# EAGLE schematic Musical_Grasping_Training_Aid_Schematic (EAGLE 9.7.0)
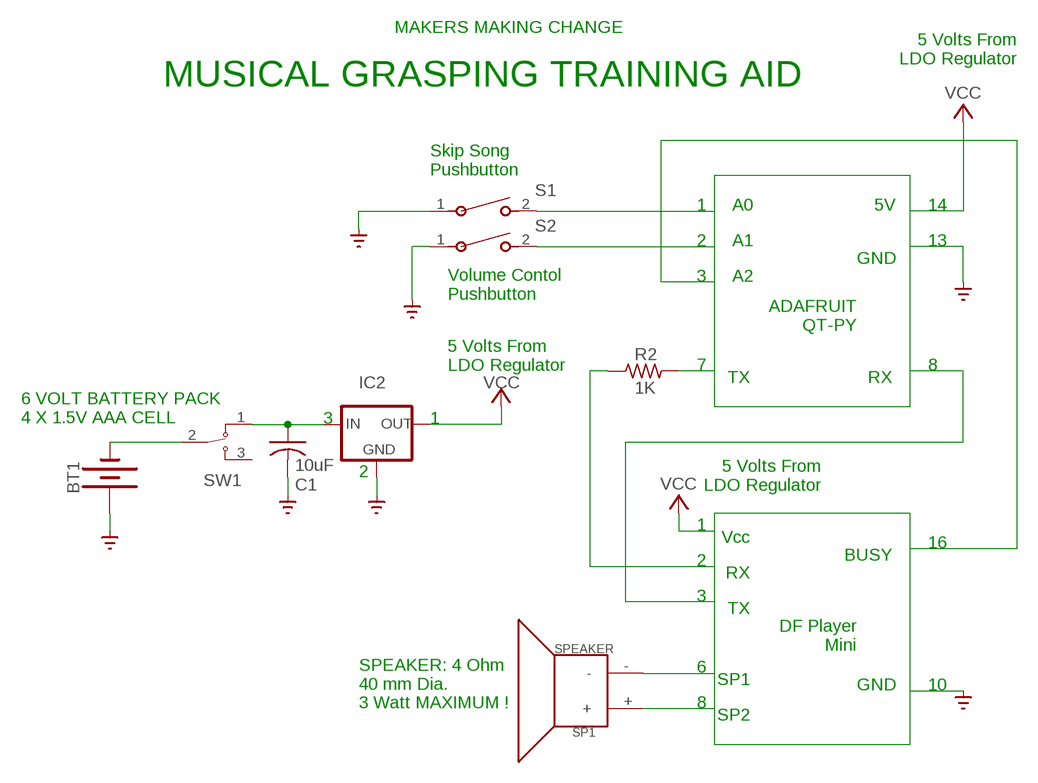
[diagram p0: schematic, sheet 1]

## Parts
BT1  BATTERY-AAA  [BATTERY-AAA]
C1  10uF  C-US025-025X050  [C025-025X050]
IC2  78LXX  [78LXX]
R2  1K  R-US_0204/7  [0204/7]
S1  1825966-1  [SWDIP2_256X170P100]
S2  1825966-1  [SWDIP2_256X170P100]
SP1  SPEAKER  [PCB_MOUNT_SPEAKER]
SW1  ATE1E-2M3-10-Z  [ATE1E-2M3-10-Z]

## Nets
GND: BT1.PWR@1(+) C1.2 IC2.GND S1.1 S2.1 ; supply symbol labelled SUPPLY0_GND_
N$1: R2.2
N$2: R2.1
N$4: S2.2
N$5: S1.2
N$6: BT1.GND@1(-) SW1.2
N$8: SP1.+ SP1.-
N$9: C1.1 IC2.IN SW1.1
VCC: IC2.OUT
Unconnected: SW1.3

## Notes on the sheet
- MAKERS MAKING CHANGE
- 5 Volts From
  LDO Regulator
- MUSICAL GRASPING TRAINING AID
- Skip Song
  Pushbutton
- 1 | A0 | 5V | 14
- 2 | A1 | 13
- GND
- 3 | A2
- Volume Contol
  Pushbutton
- ADAFRUIT
  QT-PY
- 5 Volts From
  LDO Regulator
- 7 | TX | RX | 8
- 3 | 1
- 6 VOLT BATTERY PACK
  4 X 1.5V AAA CELL
- 5 Volts From
  LDO Regulator
- 2
- 1 | Vcc
- BUSY | 16
- 2 | RX
- 3 | TX
- DF Player
  Mini
- 6 | SP1
- GND | 10
- SPEAKER: 4 Ohm
  40 mm Dia.
  3 Watt MAXIMUM !
- 8 | SP2

## Library data of the parts
BT1 = SparkFun-Batteries:BATTERY: Battery - Single Cell A variety of battery chemistries, sizes, and footprints. Device List: 20MM_PTH - Coin Cell Battery Holder - 20mm (PTH) <https://www.sparkfun.com/products/783> 6.8MM_PTH - Coin Cell Battery Holder - 6.8MM(SMD) <https://www.digikey.com/product-detail/en/seiko-instruments/MS621FE-FL11E/728-1057-ND/1889208?WT.srch=1&gclid=CNOQ5a6LzdQCFZS2wAodXCkE0g> 12MM_SMD - Coin Cell Battery Holder - 12mm (SMD) <https://www.sparkfun.com/products/10592> 12MM_PTH - Coin Cell Battery Holder - 12mm (PTH) <https://www.sparkfun.com/products/7948> 20MM_SMD - 20mm Coin Cell Battery Holder (SMD) (2 legs) Used on the Big Time Watch Kit <https://www.sparkfun.com/products/11734> 20MM_SMD_4LEGS - Coin Cell Battery Holder - 20mm (SMD) <https://www.sparkfun.com/products/11892> 20MM_SMD_4LEGS_OVERPASTE - Coin Cell Battery Holder - 20mm (SMD) <https://www.sparkfun.com/products/11892> (Over-paste on the legs) 24.5MM_PTH - Coin Cell Battery Holder - 24.5mm (PTH) <https://www.sparkfun.com/products/8863> 9V - 9V Battery Holder - PC Mount Used on the SparkFun SparkPunk Sound Kit <https://www.sparkfun.com/products/11177> and SparkFun SparkPunk Sequencer Kit <https://www.sparkfun.com/products/12707> 18650 - Battery Holder - 18650 (PTH) <https://www.sparkfun.com/products/13113> AA - Battery Holder - 1xAA (PTH) <https://www.sparkfun.com/products/7949> AAA - Battery Holder - 1xAAA (PTH) <https://www.sparkfun.com/products/12718> AA_KIT - Battery Holder - 1xAA (PTH) <https://www.sparkfun.com/products/7949> Special kit package - pads only have exposed copper on one side of the board. AAA_KIT - Battery Holder - 1xAAA (PTH) <https://www.sparkfun.com/products/12718> Special kit package - pads only have exposed copper on one side of the board.; PROD_ID: BATT-08571; SF_SKU: PRT-12718
C1 = adafruit:C-US: CAPACITOR, American symbol
IC2 = DC_LOAD_AU:78LXX: VOLTAGE REGULATOR
R2 = adafruit:R-US_: RESISTOR, American symbol
S1 S2 = Switches:1825966-1; BUILT_BY: EMA_UL_Team; CATEGORY: Tactile Switches; COPYRIGHT: Copyright (C) 2016 Accelerated Designs. All rights reserved; DESCRIPTION: FSMCH=3.5 X 6.0 X 4.3 TACT SWITCH, HT; MANUFACTURER_PART_NUMBER: 1825966-1; PART_STATUS: active; SERIES: Unknown; VENDOR: TE Connectivity
SP1 = SparkFun-Electromechanical:SPEAKER: Speaker Generic 2-terminal loudspeakers SparkFun Products Speaker - PCB Mount <https://www.sparkfun.com/products/11089> (COM-11089); PROD_ID: COMP-11789; SF_SKU: COM-11089
SW1 = Switch:ATE1E-2M3-10-Z: SWITCH TOGGLE SPDT 50MA 48V Manufacturer's datasheet <https://www.nidec-copal-electronics.com/e/catalog/switch/ate.pdf>; CREATED_BY: PCBLayout.com; DIGIKEY_PARTNO: 563-1159-ND; MANUFACTURER: Nidec Copal Electronics; MPN: ATE1E-2M3-10-Z